# Altium schematic sheet agent-mother.SchDoc: TVMD Agent Controller MCU
size A4; Author: Scieyn; DocumentNumber: 1; SheetNumber: 1; SheetTotal: 2
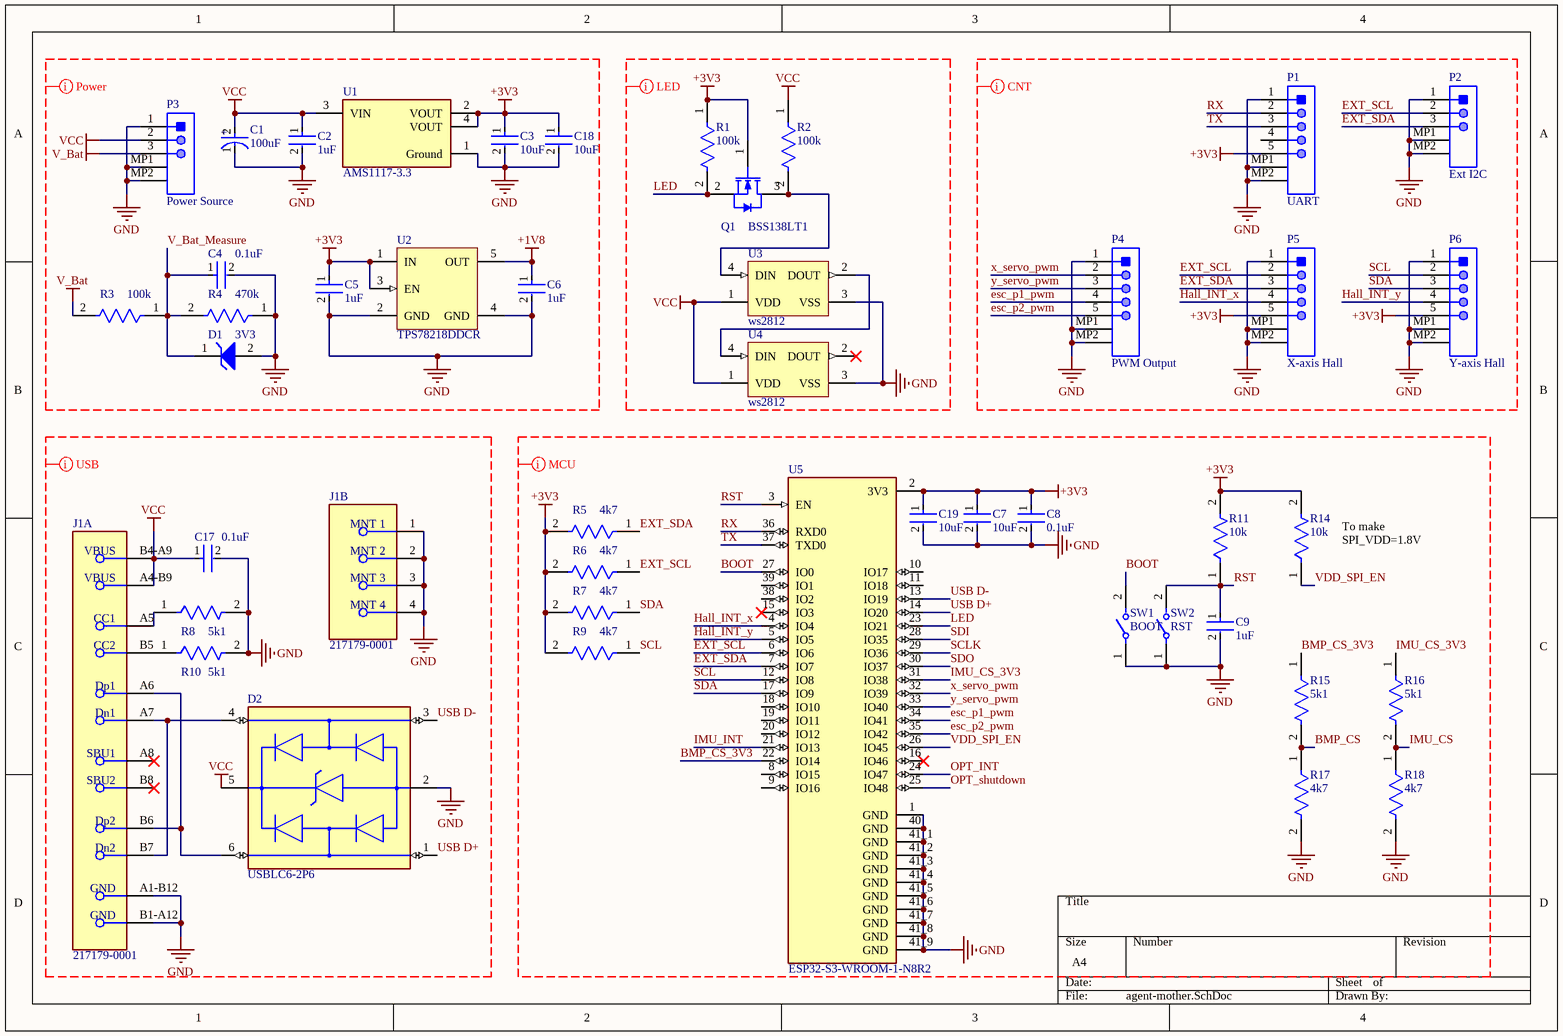
[diagram p0: agent-mother.SchDoc]

## Parts
C1  100uF  [FP-T495D107K016ATE125-MFG]
C2  1uF  [FP-C0402-BB-MFG]
C3  10uF  [FP-C0402-BB-MFG]
C4  0.1uF  [FP-C0402-BB-MFG]
C5  1uF  [FP-C0402-BB-MFG]
C6  1uF  [FP-C0402-BB-MFG]
C7  10uF  [FP-C0402-BB-MFG]
C8  0.1uF  [FP-C0402-BB-MFG]
C9  1uF  [FP-C0402-BB-MFG]
C17  0.1uF  [FP-C0402-BB-MFG]
C18  10uF  [FP-C0402-BB-MFG]
C19  10uF  [FP-C0402-BB-MFG]
D1  3V3  [ONSC-SOD-323-2-477-02_V]
D2  USBLC6-2P6  [SOT-23-6 USBLC6]
J1  217179-0001  [FP-217179-0001-MFG]  (parts A,B of 2)
P1  UART  [MOLX-52361-0571-5_V]
P2  Ext I2C  [FP-53261-0371-MFG]
P3  Power Source  [FP-53261-0371-MFG]
P4  PWM Output  [MOLX-52361-0571-5_V]
P5  X-axis Hall  [MOLX-52361-0571-5_V]
P6  Y-axis Hall  [MOLX-52361-0571-5_V]
Q1  BSS138LT1  [ONSC-SOT-23-3-318-08_V]
R1  100k  [FP-CRCW0402-e3-IPC_A]
R2  100k  [FP-CRCW0402-e3-IPC_A]
R3  100k  [FP-CRCW0402-e3-IPC_A]
R4  470k  [FP-CRCW0402-e3-IPC_A]
R5  4k7  [FP-CRCW0402-e3-IPC_A]
R6  4k7  [FP-CRCW0402-e3-IPC_A]
R7  4k7  [FP-CRCW0402-e3-IPC_A]
R8  5k1  [FP-CRCW0402-e3-IPC_A]
R9  4k7  [FP-CRCW0402-e3-IPC_A]
R10  5k1  [FP-CRCW0402-e3-IPC_A]
R11  10k  [FP-CRCW0402-e3-IPC_A]
R14  10k  [FP-CRCW0402-e3-IPC_A]
R15  5k1  [FP-CRCW0402-e3-IPC_A]
R16  5k1  [FP-CRCW0402-e3-IPC_A]
R17  4k7  [FP-CRCW0402-e3-IPC_A]
R18  4k7  [FP-CRCW0402-e3-IPC_A]
SW1  BOOT  [FP-B3U-1000P-B-MFG]
SW2  RST  [FP-B3U-1000P-B-MFG]
U1  AMS1117-3.3  [FP-AMS1117-IPC_A]
U2  TPS78218DDCR  [SOT-23-OT5_M]
U3  ws2812  [ADA-RGB-1655_V]
U4  ws2812  [ADA-RGB-1655_V]
U5  ESP32-S3-WROOM-1-N8R2  [XCVR_ESP32S3WROOM1N8R8]

## Nets
+1V8: C6.1 U2.5(OUT)
+3V3: C3.1 C5.1 C7.1 C8.1 C18.1 C19.1 P1.5 P5.5 P6.5 Q1.1(G) R1.1 R5.2 R6.2 R7.2 R9.2 R11.2 R14.2 U1.2(VOUT) U1.4(VOUT) U2.1(IN) U2.3(EN) U5.2(3V3)
GND: C1.1(C) C2.2 C3.2 C4.2 C5.2 C6.2 C7.2 C8.2 C9.2 C17.2 C18.2 C19.2 D1.2(A) D2.2(GND) J1.1(MNT_1) J1.2(MNT_2) J1.3(MNT_3) J1.4(MNT_4) J1.A1-B12(GND) J1.B1-A12(GND) P1.1 P1.MP1 P1.MP2 P2.1 P2.MP1 P2.MP2 P3.1 P3.MP1 P3.MP2 P4.1 P4.MP1 P4.MP2 P5.1 P5.MP1 P5.MP2 P6.1 P6.MP1 P6.MP2 R4.1 R8.2 R10.2 R17.2 R18.2 SW1.1 SW2.1 U1.1(Ground) U2.2(GND) U2.4(GND) U3.3(VSS) U4.3(VSS) U5.1(GND) U5.40(GND) U5.41_1(GND) U5.41_2(GND) U5.41_3(GND) U5.41_4(GND) U5.41_5(GND) U5.41_6(GND) U5.41_7(GND) U5.41_8(GND) U5.41_9(GND)
V_Bat: P3.3 R3.2
VCC: C1.2(A) C2.1 C17.1 D2.5(VBUS) J1.A4-B9(VBUS) J1.B4-A9(VBUS) P3.2 R2.1 U1.3(VIN) U3.1(VDD) U4.1(VDD)
BMP_CS: R15.2 R17.1
BMP_CS_3V3: R15.1 U5.22(IO14)
BOOT: SW1.2 U5.27(IO0)
esc_p1_pwm: P4.4 U5.34(IO41)
esc_p2_pwm: P4.5 U5.35(IO42)
EXT_SCL: P2.2 P5.2 R6.1 U5.6(IO6)
EXT_SDA: P2.3 P5.3 R5.1 U5.7(IO7)
Hall_INT_x: P5.4 U5.4(IO4)
Hall_INT_y: P6.4 U5.5(IO5)
IMU_CS: R16.2 R18.1
IMU_CS_3V3: R16.1 U5.31(IO38)
IMU_INT: U5.21(IO13)
LED: Q1.2(S) R1.2 U5.23(IO21)
OPT_INT: U5.24(IO47)
OPT_shutdown: U5.25(IO48)
RST: C9.1 R11.1 SW2.2 U5.3(EN)
RX: P1.2 U5.36(RXD0)
SCL: P6.2 R9.1 U5.12(IO8)
SCLK: U5.29(IO36)
SDA: P6.3 R7.1 U5.17(IO9)
SDI: U5.28(IO35)
SDO: U5.30(IO37)
TX: P1.3 U5.37(TXD0)
USB D+: D2.1(I/O1) U5.14(IO20)
USB D-: D2.3(I/O2) U5.13(IO19)
V_Bat_Measure: C4.1 D1.1(K) R3.1 R4.2
VDD_SPI_EN: R14.1 U5.26(IO45)
x_servo_pwm: P4.2 U5.32(IO39)
y_servo_pwm: P4.3 U5.33(IO40)
NetD2_4: D2.4(I/O2) J1.A7(Dn1) J1.B7(Dn2)
NetD2_6: D2.6(I/O1) J1.A6(Dp1) J1.B6(Dp2)
NetJ1_A5: J1.A5(CC1) R8.1
NetJ1_B5: J1.B5(CC2) R10.1
NetQ1_3: Q1.3(D) R2.2 U3.4(DIN)
NetU3_2: U3.2(DOUT) U4.4(DIN)

Not connected (* = marked no-connect by the designer): J1 A8(SBU1)* B8(SBU2)*; P1 4; U4 2(DOUT)*; U5 8(IO15) 9(IO16) 10(IO17) 11(IO18) 15(IO3)* 16(IO46)* 18(IO10) 19(IO11) 20(IO12) 38(IO2) 39(IO1)

## Layout directives
net class USB: GND, USB D+, USB D-, VCC
net class MCU: +3V3, BMP_CS, BMP_CS_3V3, BOOT, esc_p1_pwm, esc_p2_pwm, EXT_SCL, EXT_SDA, GND, Hall_INT_x, Hall_INT_y, IMU_CS, IMU_CS_3V3, IMU_INT, LED, OPT_INT, OPT_shutdown, RST, RX, SCL, SCLK, SDA, SDI, SDO, TX, USB D+, USB D-, VDD_SPI_EN, x_servo_pwm, y_servo_pwm
net class Power: +1V8, +3V3, GND, V_Bat, V_Bat_Measure, VCC
net class LED: +3V3, GND, LED, VCC
net class CNT: +3V3, esc_p1_pwm, esc_p2_pwm, EXT_SCL, EXT_SDA, GND, Hall_INT_x, Hall_INT_y, RX, SCL, SDA, TX, x_servo_pwm, y_servo_pwm

## Notes on the sheet
- (near R14) To make SPI_VDD=1.8V
- (in symbol CMP-2000-07207-2) +

## Library data of the parts
C1 = CMP-2000-07207-2: CAP TANT 100UF 10% 16V 2917; Life (Hours): 2000Hour; ESR (Equivalent Series Resistance): 125mR; Polarity: Polar; Dielectric Material: Tantalum; Dissipation Factor: 8%; Capacitance: 100uF; Radiation Hardening: No; RoHS Compliant: Yes; Length: 7.3mm; Features: General Purpose; Packaging: Tape and Reel; Package Quantity: 1; Weight: 0.023634oz; Voltage Rating: 16V; Width: 0.169inch; Case/Package: 2917; Mount: Surface Mount; Voltage: 16V; Min Operating Temperature: -55°C; Tolerance: 10%; REACH SVHC: No SVHC; Height - Seated (Max): 0.122inch; Number of Pins: 2; Construction: Flat; Depth: 4.3mm; Series: T495; Max Operating Temperature: 125°C; Failure Rate: 0.001%; Termination: SMD/SMT; Voltage Rating (DC): 16V; Case Code (Imperial): 2917; Case Code (Metric): 7343; Height: 2.8mm
C2 C5 C6 C9 = CMP-2008-02108-2: CAP CER 1uF 16V X7R 0402; Manufacturer: Kemet; Manufacturer Part Number: C0402C104K4RACTU; Value: 0.1uF; Tolerance: 0.1; Material: Ceramic; Temperature Coefficient: 15%; Voltage Rating: 16 V; Package: C0402-BB; Automotive: No; Ipc Land Pattern Name: CAPC10050X50; Device Class L3: Ceramic Capacitors; Capacitance: 0.1uF; Octopart: https://octopart.com/c0402c104k4ractu-kemet-94158; Temperature Characteristic: X7R; Mouser Description: Cap Ceramic 0.1uF 16V X7R 10% SMD 0402 125?C Paper T/R - Tape and Reel (Alt: C0402C104K4RAC TU); ComponentLink2Description: Datasheet; Temperature Range Low: -55°C; RoHS: TRUE; Device Class L1: Passive Components; Temperature Range High: +125°C; Device Class L2: Capacitors; ComponentLink2URL: https://content.kemet.com/datasheets/KEM_C1002_X7R_SMD.pdf; Category: Cap; Height: 0.55mm; Temperature: -55°C to +125°C; Lead Free: Yes; Digikey Description: CAP CER 0.1UF 16V X7R 0402
C3 C7 C18 C19 = CMP-2008-02108-2: CAP CER 22uF 16V X7R 0402; Manufacturer: Kemet; Manufacturer Part Number: C0402C104K4RACTU; Value: 0.1uF; Tolerance: 0.1; Material: Ceramic; Temperature Coefficient: 15%; Voltage Rating: 16 V; Package: C0402-BB; Automotive: No; Ipc Land Pattern Name: CAPC10050X50; Device Class L3: Ceramic Capacitors; Capacitance: 0.1uF; Octopart: https://octopart.com/c0402c104k4ractu-kemet-94158; Temperature Characteristic: X7R; Mouser Description: Cap Ceramic 0.1uF 16V X7R 10% SMD 0402 125?C Paper T/R - Tape and Reel (Alt: C0402C104K4RAC TU); ComponentLink2Description: Datasheet; Temperature Range Low: -55°C; RoHS: TRUE; Device Class L1: Passive Components; Temperature Range High: +125°C; Device Class L2: Capacitors; ComponentLink2URL: https://content.kemet.com/datasheets/KEM_C1002_X7R_SMD.pdf; Category: Cap; Height: 0.55mm; Temperature: -55°C to +125°C; Lead Free: Yes; Digikey Description: CAP CER 0.1UF 16V X7R 0402
C4 C8 C17 = CMP-2008-02108-2: CAP CER 0.1uF 16V X7R 0402; Manufacturer: Kemet; Manufacturer Part Number: C0402C104K4RACTU; Tolerance: 0.1; Material: Ceramic; Temperature Coefficient: 15%; Voltage Rating: 16 V; Package: C0402-BB; Automotive: No; Ipc Land Pattern Name: CAPC10050X50; Device Class L3: Ceramic Capacitors; Value: 0.1uF; Capacitance: 0.1uF; Octopart: https://octopart.com/c0402c104k4ractu-kemet-94158; Temperature Characteristic: X7R; Mouser Description: Cap Ceramic 0.1uF 16V X7R 10% SMD 0402 125?C Paper T/R - Tape and Reel (Alt: C0402C104K4RAC TU); ComponentLink2Description: Datasheet; Temperature Range Low: -55°C; RoHS: TRUE; Device Class L1: Passive Components; Temperature Range High: +125°C; Device Class L2: Capacitors; ComponentLink2URL: https://content.kemet.com/datasheets/KEM_C1002_X7R_SMD.pdf; Category: Cap; Height: 0.55mm; Temperature: -55°C to +125°C; Lead Free: Yes; Digikey Description: CAP CER 0.1UF 16V X7R 0402
D1 = CMP-1060-00672-1: Zener Voltage Regulator, 300 mW, 2-Pin SOD-323, Pb-Free, Tape and Reel; PartNumber: MM3Z3V3T1G; Manufacturer: On Semiconductor; VZ Typ (V): 3.3; P Max (W): 0.3; ComponentLink1URL: http://www.onsemi.com/; ComponentLink2Description: Datasheet; PackageVersion: Rev. H, 03/2007; PackageReference: SOD-323-2-477-02; ComponentLink1Description: Manufacturer URL; PackageDescription: 2-Pin SOD, Body 1.7 x 1.25 mm; RoHS: Pb-Free; ComponentLink3Description: Package Specification; Packing: Tape and Reel; DatasheetVersion: Rev. 9; ComponentLink3URL: http://www.onsemi.com/pub_link/Collateral/477-02.PDF.1; Mounting Technology: Surface Mount; ComponentLink2URL: http://www.onsemi.cn/pub_link/Collateral/MM3Z2V4T1-D.PDF
D2 = USBLC6-2P6: TVS DIODE 5.25V 17V SOT666; Min Breakdown Voltage: 6V; Power Line Protection: Yes; Element Configuration: Dual; Test Current: 1mA; Working Voltage: 5V; Number of Channels: 2; Max Reverse Leakage Current: 150nA; Direction: Unidirectional; Peak Pulse Current: 5A; Number of Elements: 1; Capacitance: 3.5pF; Max Breakdown Voltage: 6V; Height: 0.6mm; Depth: 1.3mm; Contact Plating: Tin; Reverse Breakdown Voltage: 6V; REACH SVHC: No SVHC; Operating Supply Voltage: 5V; Width: 1.3mm; Max Operating Temperature: 125°C; Reverse Standoff Voltage: 5V; ESD Protection: Yes; Package Quantity: 1; Termination: SMD/SMT; Length: 1.7mm; Leakage Current: 150nA; Number of Bidirectional Channels: 2; Case/Package: SOT-666; Min Operating Temperature: -40°C; Number of Pins: 6; Clamping Voltage: 17V; Breakdown Voltage: 6V; Lead Free: Lead Free; Radiation Hardening: No; Packaging: Tape and Reel; Mount: Surface Mount; Polarity: Unidirectional
J1 = CMP-04767-000028-1: CONN RCP USB2.0 TYP C 24P SMD RA
P1 P4-P6 = CMP-2000-05249-1: Male Header, Pitch 1.25 mm, 1 x 5 Position, Height 3.4 mm, RoHS, Tape and Reel; Brand: Molex; Mounting Angle: Right; Number of Positions: 5; Voltage Rating: 125V; Current Rating: 1A; Pitch: 1.25mm; Datasheet Version: Rev. D, 04/2004; Housing Material: Thermoplastic; Series: 53261; RoHS: Details; Product Category: Headers&WireHousings; Datasheet URL: http://datasheet.octopart.com/532610571-Molex-datasheet-8343080.pdf; Manufacturer URL: http://www.molex.com/; Contact Material: PhosphorBronze; Tradename: PicoBlade; Number of Rows: 1; Product Type: Headers; Manufacturer: Molex; Type: Shrouded; Termination Style: SMD; Mounting Style: SMD/SMT; Factory Pack Quantity: 1000; Contact Plating: Tin; Packaging: Reel; Number of Positions / Contacts: 5
P2 P3 = CMP-04776-000071-1: CONN HEADER SMD R/A 3POS 1.25MM; pin to pad: MP1>4 MP2>5; Manufacturer: Molex; Manufacturer Part Number: 53261-0371; Number Of Contacts: 3; Conn Orientation: Right Angle; Current Rating: 1A; Voltage Rating: 125V; Conn Gender: Male; Category: Conn; Automotive: No; Footprint Url: https://www.molex.com/pdm_docs/sd/532610371_sd.pdf; Height: 3.6mm; Number Of Rows: 1; Temperature Range Low: -40°C; Package: 0; Octopart: https://octopart.com/53261-0371-molex-655314; ComponentLink2Description: Datasheet; Lead Free: Yes; Ambient Temperature Range Low: -40°C; Device Class L3: unset; Mouser Description: 1.25mm (.049") Pitch PicoBlade Header, Surface Mount, Right Angle, Lead-free, 3 Circuits; Digikey Description: CONN HEADER SMD R/A 3POS 1.25MM; Device Class L2: Headers and Wire Housings; Contact Material: Tin,Nickel; Ambient Temperature Range High: +105°C; ComponentLink2URL: https://www.molex.com/webdocs/datasheets/pdf/en-us/0532610371_PCB_HEADERS.pdf; Pitch: 1.25mm; Temperature: -40°C to +105°C; RoHS: TRUE; Device Class L1: Connectors; Temperature Range High: +105°C
Q1 = CMP-1058-00761-1: Power MOSFET, BSS138LT1, 200 mA, 50 V, N-Channel, 3-Pin SOT-23, Tape and Reel; Manufacturer: On Semiconductor; Crss Typ (pF): 3.5; PD Max (W): 0.225; Coss Typ (pF): 12; Channel Polarity: N Channel; ID Max (A): 0.2; VGS(th) Max (V): 1.5; VGS Max (V): 20; Ciss Typ (pF): 40; V(BR)DSS Min (V): 50; Configuration: Single; ComponentLink3Description: Package Specification; ComponentLink2URL: http://www.onsemi.com/pub_link/Collateral/BSS138LT1-D.PDF; ComponentLink2Description: Datasheet; ComponentLink1URL: http://www.onsemi.com/; PackageVersion: Rev. AP, 11/2009; PartNumber: BSS138LT1; PackageReference: SOT-23-3-318-08; PackageDescription: 3-Pin Small Outline Transistor, Body 2.92 x 1.3 mm, Pitch 0.95 mm; ComponentLink3URL: http://www.onsemi.cn/pub_link/Collateral/318-08.PDF; Mounting Technology: Surface Mount; Packing: Tape and Reel; ComponentLink1Description: Manufacturer URL; DatasheetVersion: Rev. 8; Package Type: SOT-23-3
R1-R3 = CMP-2002-08122-2: RES Thick Film, 100kΩ, 0.063W, 0402; Tolerance: 5%; Max Power Dissipation: 63mW; Voltage Rating: 50V; Temperature Coefficient: 100ppm/°C; Resistance: 5k1; Contact Plating: Tin; Height: 0.35mm; Radiation Hardening: No; Features: Automotive AEC-Q200; Composition: Thick Film; Width: 0.5mm; Weight: 2.3E-05oz; Termination: SMD/SMT; Packaging: Tape and Reel; Mount: Surface Mount; Case Code (Metric): 1005; Military Standard: Not; Min Operating Temperature: -55°C; Number of Terminations: 2; Package Quantity: 1; Case Code (Imperial): 0402; Depth: 0.5mm; Max Operating Temperature: 155°C; Case/Package: 0402; Power Rating: 63mW; Lead Free: Lead Free; Voltage Rating (DC): 50V; Length: 1mm
R4 = CMP-2002-08122-2: RES Thick Film, 470kΩ, 0.063W, 0402; Tolerance: 5%; Max Power Dissipation: 63mW; Voltage Rating: 50V; Temperature Coefficient: 100ppm/°C; Resistance: 5k1; Contact Plating: Tin; Height: 0.35mm; Radiation Hardening: No; Features: Automotive AEC-Q200; Composition: Thick Film; Width: 0.5mm; Weight: 2.3E-05oz; Termination: SMD/SMT; Packaging: Tape and Reel; Mount: Surface Mount; Case Code (Metric): 1005; Military Standard: Not; Min Operating Temperature: -55°C; Number of Terminations: 2; Package Quantity: 1; Case Code (Imperial): 0402; Depth: 0.5mm; Max Operating Temperature: 155°C; Case/Package: 0402; Power Rating: 63mW; Lead Free: Lead Free; Voltage Rating (DC): 50V; Length: 1mm
R5-R7 R9 R17 R18 = CMP-2002-08122-2: RES Thick Film, 4k7Ω, 0.063W, 0402; Tolerance: 5%; Max Power Dissipation: 63mW; Voltage Rating: 50V; Temperature Coefficient: 100ppm/°C; Resistance: 5k1; Contact Plating: Tin; Height: 0.35mm; Radiation Hardening: No; Features: Automotive AEC-Q200; Composition: Thick Film; Width: 0.5mm; Weight: 2.3E-05oz; Termination: SMD/SMT; Packaging: Tape and Reel; Mount: Surface Mount; Case Code (Metric): 1005; Military Standard: Not; Min Operating Temperature: -55°C; Number of Terminations: 2; Package Quantity: 1; Case Code (Imperial): 0402; Depth: 0.5mm; Max Operating Temperature: 155°C; Case/Package: 0402; Power Rating: 63mW; Lead Free: Lead Free; Voltage Rating (DC): 50V; Length: 1mm
R8 R10 = CMP-2002-08122-2: RES Thick Film, 5k1Ω, 0.063W, 0402; Tolerance: 5%; Max Power Dissipation: 63mW; Voltage Rating: 50V; Temperature Coefficient: 100ppm/°C; Contact Plating: Tin; Height: 0.35mm; Radiation Hardening: No; Features: Automotive AEC-Q200; Composition: Thick Film; Width: 0.5mm; Weight: 2.3E-05oz; Termination: SMD/SMT; Packaging: Tape and Reel; Mount: Surface Mount; Case Code (Metric): 1005; Military Standard: Not; Min Operating Temperature: -55°C; Number of Terminations: 2; Package Quantity: 1; Case Code (Imperial): 0402; Depth: 0.5mm; Max Operating Temperature: 155°C; Case/Package: 0402; Resistance: 5k1; Power Rating: 63mW; Lead Free: Lead Free; Voltage Rating (DC): 50V; Length: 1mm
R11 R14 = CMP-2002-08122-2: RES Thick Film, 10kΩ, 0.063W, 0402; Tolerance: 5%; Max Power Dissipation: 63mW; Voltage Rating: 50V; Temperature Coefficient: 100ppm/°C; Resistance: 5k1; Contact Plating: Tin; Height: 0.35mm; Radiation Hardening: No; Features: Automotive AEC-Q200; Composition: Thick Film; Width: 0.5mm; Weight: 2.3E-05oz; Termination: SMD/SMT; Packaging: Tape and Reel; Mount: Surface Mount; Case Code (Metric): 1005; Military Standard: Not; Min Operating Temperature: -55°C; Number of Terminations: 2; Package Quantity: 1; Case Code (Imperial): 0402; Depth: 0.5mm; Max Operating Temperature: 155°C; Case/Package: 0402; Power Rating: 63mW; Lead Free: Lead Free; Voltage Rating (DC): 50V; Length: 1mm
R15 R16 = CMP-2002-08122-2: RES Thick Film, 4k7Ω, 0.063W, 0402; Tolerance: 5%; Max Power Dissipation: 63mW; Voltage Rating: 50V; Temperature Coefficient: 100ppm/°C; Contact Plating: Tin; Height: 0.35mm; Radiation Hardening: No; Features: Automotive AEC-Q200; Composition: Thick Film; Width: 0.5mm; Weight: 2.3E-05oz; Termination: SMD/SMT; Packaging: Tape and Reel; Mount: Surface Mount; Case Code (Metric): 1005; Military Standard: Not; Min Operating Temperature: -55°C; Number of Terminations: 2; Package Quantity: 1; Case Code (Imperial): 0402; Depth: 0.5mm; Max Operating Temperature: 155°C; Case/Package: 0402; Resistance: 5k1; Power Rating: 63mW; Lead Free: Lead Free; Voltage Rating (DC): 50V; Length: 1mm
SW1 SW2 = CMP-08834-000005-1: SWITCH TACTILE SPST-NO 0.05A 12V; Manufacturer Part Number: B3U-1000P-B; Manufacturer: Omron; Operating Force: 1.5N; Contact Current Rating: 50mA; Contact Resistance: 100mΩ; Electromechanical Life: 200000Cycles; Height: 1.75mm; Device Class L2: Switches; Temperature Range High: +70°C; Digikey Description: SWITCH TACTILE SPST-NO 0.05A 12V; Throw Configuration: SPST-NO; Ambient Temperature Range High: +70°C; Temperature: -25°C to +70°C; Lead Free: Yes; ComponentLink2URL: https://omronfs.omron.com/en_US/ecb/products/pdf/en-b3u.pdf; Device Class L3: Tactile Switches; Ambient Temperature Range Low: -25°C; Mount: Surface Mount; Automotive: No; Mouser Description: Tactile Switches Top Actuated with boss w/o ground; Octopart: https://octopart.com/b3u-1000p-b-omron-1057356; RoHS: TRUE; Package: 0; Device Class L1: Electromechanical; Voltage Rating Dc: 12V; Category: Switch; Temperature Range Low: -25°C; ComponentLink2Description: Datasheet
U1 = CMP-209535-000001-1: LDO Voltage Regulators 1A, 3.3V; Manufacturer: Advanced Monolithic Systems; Dropout Voltage: 1.1V; Output Type: Fixed; Nominal Supply Current: 5mA; Max Power Dissipation: 1.2W; Max Supply Voltage: 15V; Number Of Outputs: 1; Standoff Height: 0.64mm; Max Junction Temp: +125°C; Height: 1.8mm; Package: AMS1117; Device Class L2: Power Management ICs; ComponentLink2Description: Datasheet; ComponentLink2URL: http://www.advanced-monolithic.com/pdf/ds1117.pdf; Category: IC; RoHS: TRUE; Automotive: No; Device Class L1: Integrated Circuits (ICs); Output Current: 1A; Device Class L3: Voltage Regulators - Linear; Temperature: -40°C to +125°C; Output Voltage: 3.3V; Manufacturer Part Number: AMS1117-3.3; Temperature Range Low: -40°C; Octopart: https://octopart.com/ams1117-3.3-advanced+monolithic+systems-25899300; Lead Free: Yes; Ipc Land Pattern Name: SOT229P700X180-4; Temperature Range High: +125°C
U2 = TI-TPS782XXDRV6-1600X1000TP: Single Output LDO, 150 mA, Fixed 1.8 V Output, 2.2 to 5.5 V Input, with 0.5 uA Quiescent Current, 6-pin SON (DRV), -40 to 125 degC, Green (RoHS & no Sb/Br); Manufacturer: Texas Instruments; PartNumber: TPS78218DRVR; Vin(Max)(V): 5.5; Rating: Catalog; Vout Adj(Max)(V): 1.8; Iq(Typ)(mA): 0.0005; SubFamily: Single Channel LDO; Vdo(Typ)(mV): 130; Vin(Min)(V): 2.2; Iout(Max)(A): 0.15; Accuracy(%): 3; Mounting Technology: Surface Mount; PackageDescription: 6-Pin Plastic Small Outline No-Lead, Body 2 x 2 mm, Pitch 0.65 mm; PackageVersion: 4206925/E; PackageReference: DRV0006A; ComponentLink3Description: Package Specification; Fixed Output Options(V): 1.8; ComponentLink1Description: Manufacturer URL; DatasheetVersion: SBVS115B; Vout Adj(Min)(V): 1.8; ComponentLink2Description: Datasheet; Eco-Plan: Green (RoHS & no Sb/Br); ComponentLink2URL: http://www.ti.com/general/docs/lit/getliterature.tsp?genericPartNumber=TPS78218&fileType=pdf; ComponentLink3URL: http://www.ti.com/litv/pdf/mpds216d; ComponentLink1URL: http://www.ti.com/
U3 U4 = CMP-2000-05026-1: Intelligent Control LED Integrated Light Source, 3.5 to 5.3 V, -25 to 80 degC, 4-Pin SMD, RoHS, Tape and Reel; Manufacturer: Adafruit-Industries-LLC; Number of LEDs: 10; Configuration: Discrete; Utilized LED: WS2812(5050); Datasheet URL: http://datasheet.octopart.com/ADA1655-Adafruit-Industries-datasheet-32028139.pdf; Series: Neopixel; Interface: -; Package Description: 4-Pin Surface Mount Device, Body 5 x 5 mm; Color: Red,Green,Blue(RGB); Category: Optoelectronics; Controller Type: -; Package Reference: 1655; Manufacturer URL: https://www.adafruit.com/; Mounting Type: SurfaceMount; Datasheet Version: May-13; Size / Dimension: 5.00mmLx5.00mmW; Family: Addressable,Specialty
U5 = ESP32-S3-WROOM-1-N8R8: Bluetooth, WiFi 802.11b/g/n, Bluetooth v5.0 Transceiver Module 2.4GHz PCB Trace Surface Mount; MF: Espressif Systems; Package: None; Price: None; Check_prices: https://www.snapeda.com/parts/ESP32-S3-WROOM-1-N8R8/Espressif+Systems/view-part/?ref=eda; Value: *; SnapEDA_Link: https://www.snapeda.com/parts/ESP32-S3-WROOM-1-N8R8/Espressif+Systems/view-part/?ref=snap; MP: ESP32-S3-WROOM-1-N8R8; Availability: In Stock; Purchase-URL: https://pricing.snapeda.com/search?q=ESP32-S3-WROOM-1-N8R8&ref=eda